# EAGLE schematic power_sub_module (EAGLE 7.6.0)
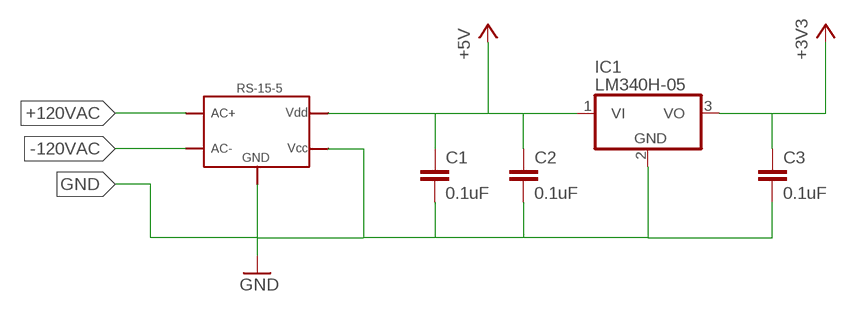
[diagram p0: schematic, sheet 1]

## Parts
C1  0.1uF  C-EU025-024X044  [C025-024X044]
C2  0.1uF  C-EU025-024X044  [C025-024X044]
C3  0.1uF  C-EU025-024X044  [C025-024X044]
IC1  LM340H-05  [TO220H]
U$1  MOTOR  [MOTOR]

## Nets
+3V3: C3.1 IC1.3(VO)
+5V: C1.1 C2.1 IC1.1(VI)
GND: C1.2 C2.2 C3.2 IC1.2(GND)

## Library data of the parts
C1-C3 = rcl:C-EU: CAPACITOR, European symbol
IC1 = linear:LM340?-*: Positive VOLTAGE REGULATOR Source: http://cache.national.com/ds/LM/LM340.pdf
U$1 = RS-15-5:MOTOR